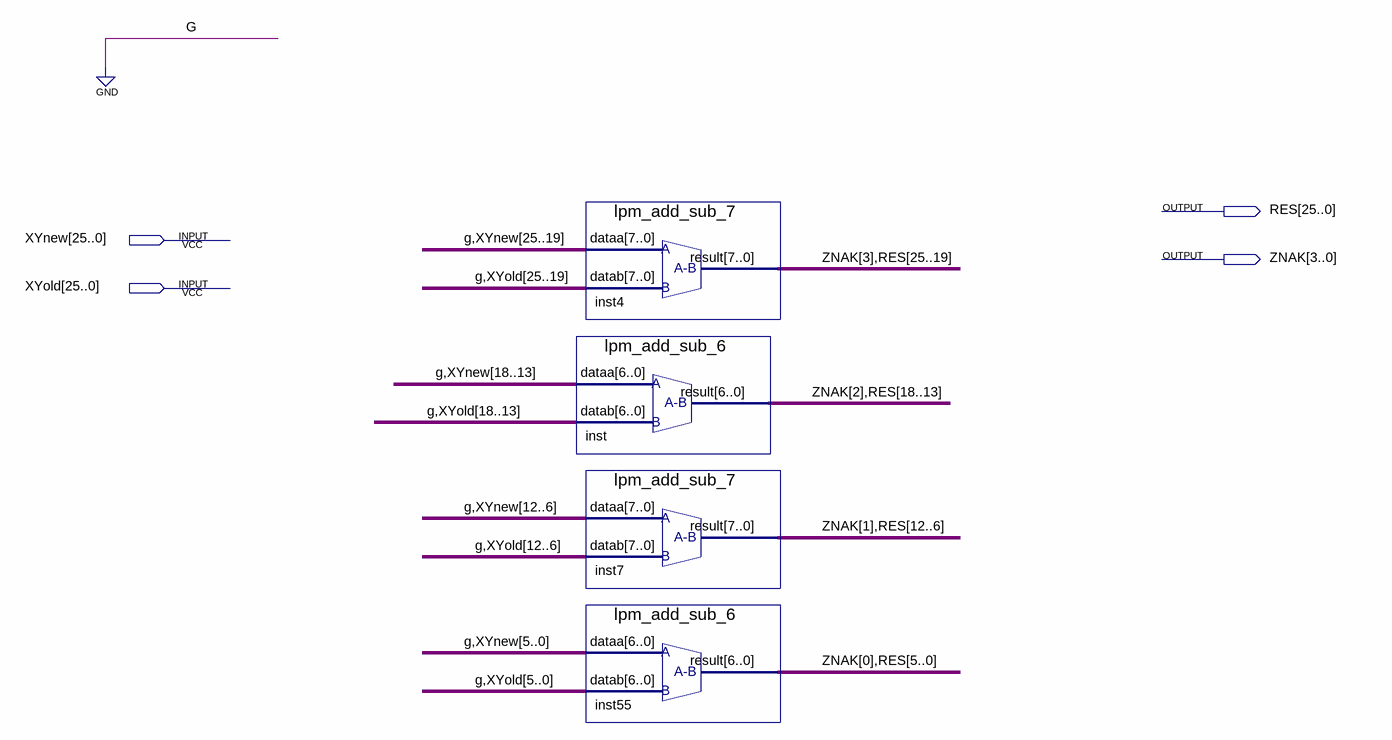
[diagram p0: schematic sheet]
// Quartus schematic dXdY_26.bdf as structural Verilog: 4 symbols, 4 pins
module dXdY_26 (
  input  [25:0] XYnew,
  input  [25:0] XYold,
  output [25:0] RES,
  output [3:0] ZNAK
);

  lpm_add_sub_7 inst4 (.dataa({1'b0, XYnew[25:19]}), .datab({1'b0, XYold[25:19]}), .result({ZNAK[3], RES[25:19]}));
  lpm_add_sub_6 inst (.dataa({1'b0, XYnew[18:13]}), .datab({1'b0, XYold[18:13]}), .result({ZNAK[2], RES[18:13]}));
  lpm_add_sub_7 inst7 (.dataa({1'b0, XYnew[12:6]}), .datab({1'b0, XYold[12:6]}), .result({ZNAK[1], RES[12:6]}));
  lpm_add_sub_6 inst55 (.dataa({1'b0, XYnew[5:0]}), .datab({1'b0, XYold[5:0]}), .result({ZNAK[0], RES[5:0]}));
endmodule
